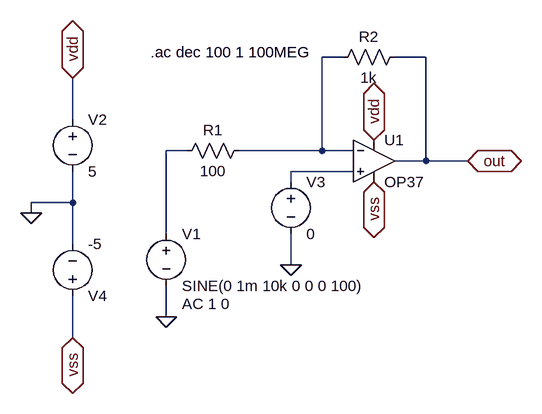
[diagram p0: schematic Priklad2.asc]
Priklad2.asc, the LTspice schematic file:
Version 4
SHEET 1 960 680
WIRE 336 -128 304 -128
WIRE 464 -128 416 -128
WIRE -80 -32 -80 -96
WIRE 96 16 64 16
WIRE 304 16 304 -128
WIRE 304 16 176 16
WIRE 352 16 304 16
WIRE 464 32 464 -128
WIRE 464 32 416 32
WIRE 528 32 464 32
WIRE 352 48 256 48
WIRE 256 64 256 48
WIRE -80 96 -80 48
WIRE -80 96 -144 96
WIRE -144 112 -144 96
WIRE 64 144 64 16
WIRE -80 160 -80 96
WIRE 256 192 256 144
WIRE 64 272 64 224
WIRE -80 304 -80 240
FLAG 64 272 0
FLAG 256 192 0
FLAG -144 112 0
FLAG -80 304 vss
IOPIN -80 304 BiDir
FLAG 384 64 vss
IOPIN 384 64 BiDir
FLAG -80 -96 vdd
IOPIN -80 -96 BiDir
FLAG 384 0 vdd
IOPIN 384 0 BiDir
FLAG 528 32 out
IOPIN 528 32 BiDir
SYMBOL voltage -80 -48 R0
WINDOW 123 24 124 Left 2
WINDOW 39 0 0 Left 2
SYMATTR InstName V2
SYMATTR Value 5
SYMBOL voltage -80 256 M180
WINDOW 123 24 124 Left 2
WINDOW 39 0 0 Left 2
SYMATTR InstName V4
SYMATTR Value -5
SYMBOL voltage 64 128 R0
WINDOW 123 24 124 Left 2
WINDOW 39 0 0 Left 2
SYMATTR InstName V1
SYMATTR Value SINE(0 1m 10k 0 0 0 100)
SYMATTR Value2 AC 1 0
SYMBOL voltage 256 48 R0
WINDOW 123 0 0 Left 2
WINDOW 39 0 0 Left 2
SYMATTR InstName V3
SYMATTR Value 0
SYMBOL res 192 0 R90
WINDOW 0 0 56 VBottom 2
WINDOW 3 32 56 VTop 2
SYMATTR InstName R1
SYMATTR Value 100
SYMBOL res 432 -144 R90
WINDOW 0 0 56 VBottom 2
WINDOW 3 32 56 VTop 2
SYMATTR InstName R2
SYMATTR Value 1k
SYMBOL Opamps\\OP37 384 -32 R0
SYMATTR InstName U1
TEXT 40 -136 Left 2 !.ac dec 100 1 100MEG

The netlist it stands for:
* Priklad2.asc
V2 vdd 0 5
V4 vss 0 -5
V1 N002 0 SINE(0 1m 10k 0 0 0 100) AC 1 0
V3 N003 0 0
R1 N001 N002 100
R2 out N001 1k
XU1 N003 N001 vdd vss out LT1037  ; OP37, pins In+ In- V+ V- OUT
.ac dec 100 1 100MEG
.lib LTC.lib
.backanno
.end